# Altium schematic sheet Sheet7.SchDoc
size A4
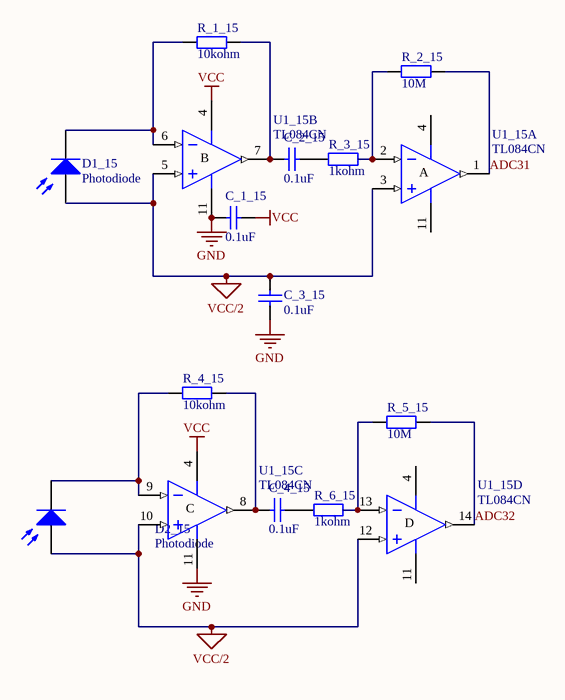
[diagram p0: Sheet7.SchDoc]

## Parts
C_1_15  0.1uF  [cms805 - mini]
C_2_15  0.1uF  [cms805 - mini]
C_3_15  0.1uF  [cms805 - mini]
C_4_15  0.1uF  [cms805 - mini]
D1_15  Photodiode  [TEMD1000]
D2_15  Photodiode  [TEMD1000]
R_1_15  10kohm  [cms805 - mini]
R_2_15  10M  [cms805 - mini]
R_3_15  1kohm  [cms805 - mini]
R_4_15  10kohm  [cms805 - mini]
R_5_15  10M  [cms805 - mini]
R_6_15  1kohm  [cms805 - mini]
U1_15  TL084CN  [TSSOP14]  (parts A,B,C,D of 4)

## Nets
GND: C_1_15.1 C_3_15.1 U1_15.11(V-)
VCC: C_1_15.2 U1_15.4(V+)
VCC/2: C_3_15.2 D1_15.1(A) D2_15.1(A) U1_15.3(IN+) U1_15.5(IN+) U1_15.10(IN+) U1_15.12(IN+)
ADC31: R_2_15.2 U1_15.1(OUT)
ADC32: R_5_15.2 U1_15.14(OUT)
NetC_2_15_1: C_2_15.1 R_3_15.1
NetC_2_15_2: C_2_15.2 R_1_15.2 U1_15.7(OUT)
NetC_4_15_1: C_4_15.1 R_6_15.1
NetC_4_15_2: C_4_15.2 R_4_15.2 U1_15.8(OUT)
NetD1_15_2: D1_15.2(K) R_1_15.1 U1_15.6(IN-)
NetD2_15_2: D2_15.2(K) R_4_15.1 U1_15.9(IN-)
NetR_2_15_1: R_2_15.1 R_3_15.2 U1_15.2(IN-)
NetR_5_15_1: R_5_15.1 R_6_15.2 U1_15.13(IN-)

## Notes on the sheet
- (in symbol TL084CN, part A) A
- (in symbol TL084CN, part B) B
- (in symbol TL084CN, part C) C
- (in symbol TL084CN, part D) D

## Library data of the parts
C_1_15 C_2_15 C_3_15 C_4_15 = Capa
R_1_15 R_2_15 R_3_15 R_4_15 R_5_15 R_6_15 = Resistance
U1_15 = TL084CN: General-Purpose J-FET Quad Operational Amplifier; Published: 24-Aug-2001; LatestRevisionDate: 06-Jun-2005; LatestRevisionNote: Stylized 3D Model Added.; DatasheetVersion: Jan-1999; PackageVersion: Jan-1997; PackageReference: DIP14; Publisher: Altium Limited; PackageDescription: DIP; 14 Leads; Row Spacing 7.62 mm; Pitch 2.54 mm; ComponentLink1Description: Manufacturer Link; ComponentLink1URL: http://www.st.com/; ComponentLink2Description: Datasheet; ComponentLink2URL: http://www.st.com/stonline/products/literature/ds/2301/tl084.pdf
D1_15 D2_15 = Photodiode: Published: 24-Mar-1999; LatestRevisionDate: 17-Jul-2002; LatestRevisionNote: Re-released for DXP Platform.; PackageReference: PIN2; Publisher: Altium Limited